# EasyEDA schematic schematic.json
TITLE: Sheet_1; REV: 1.0; Date: 2024-07-02; Sheet: 1/1; Drawn By: usedgenes; Company: Your Company
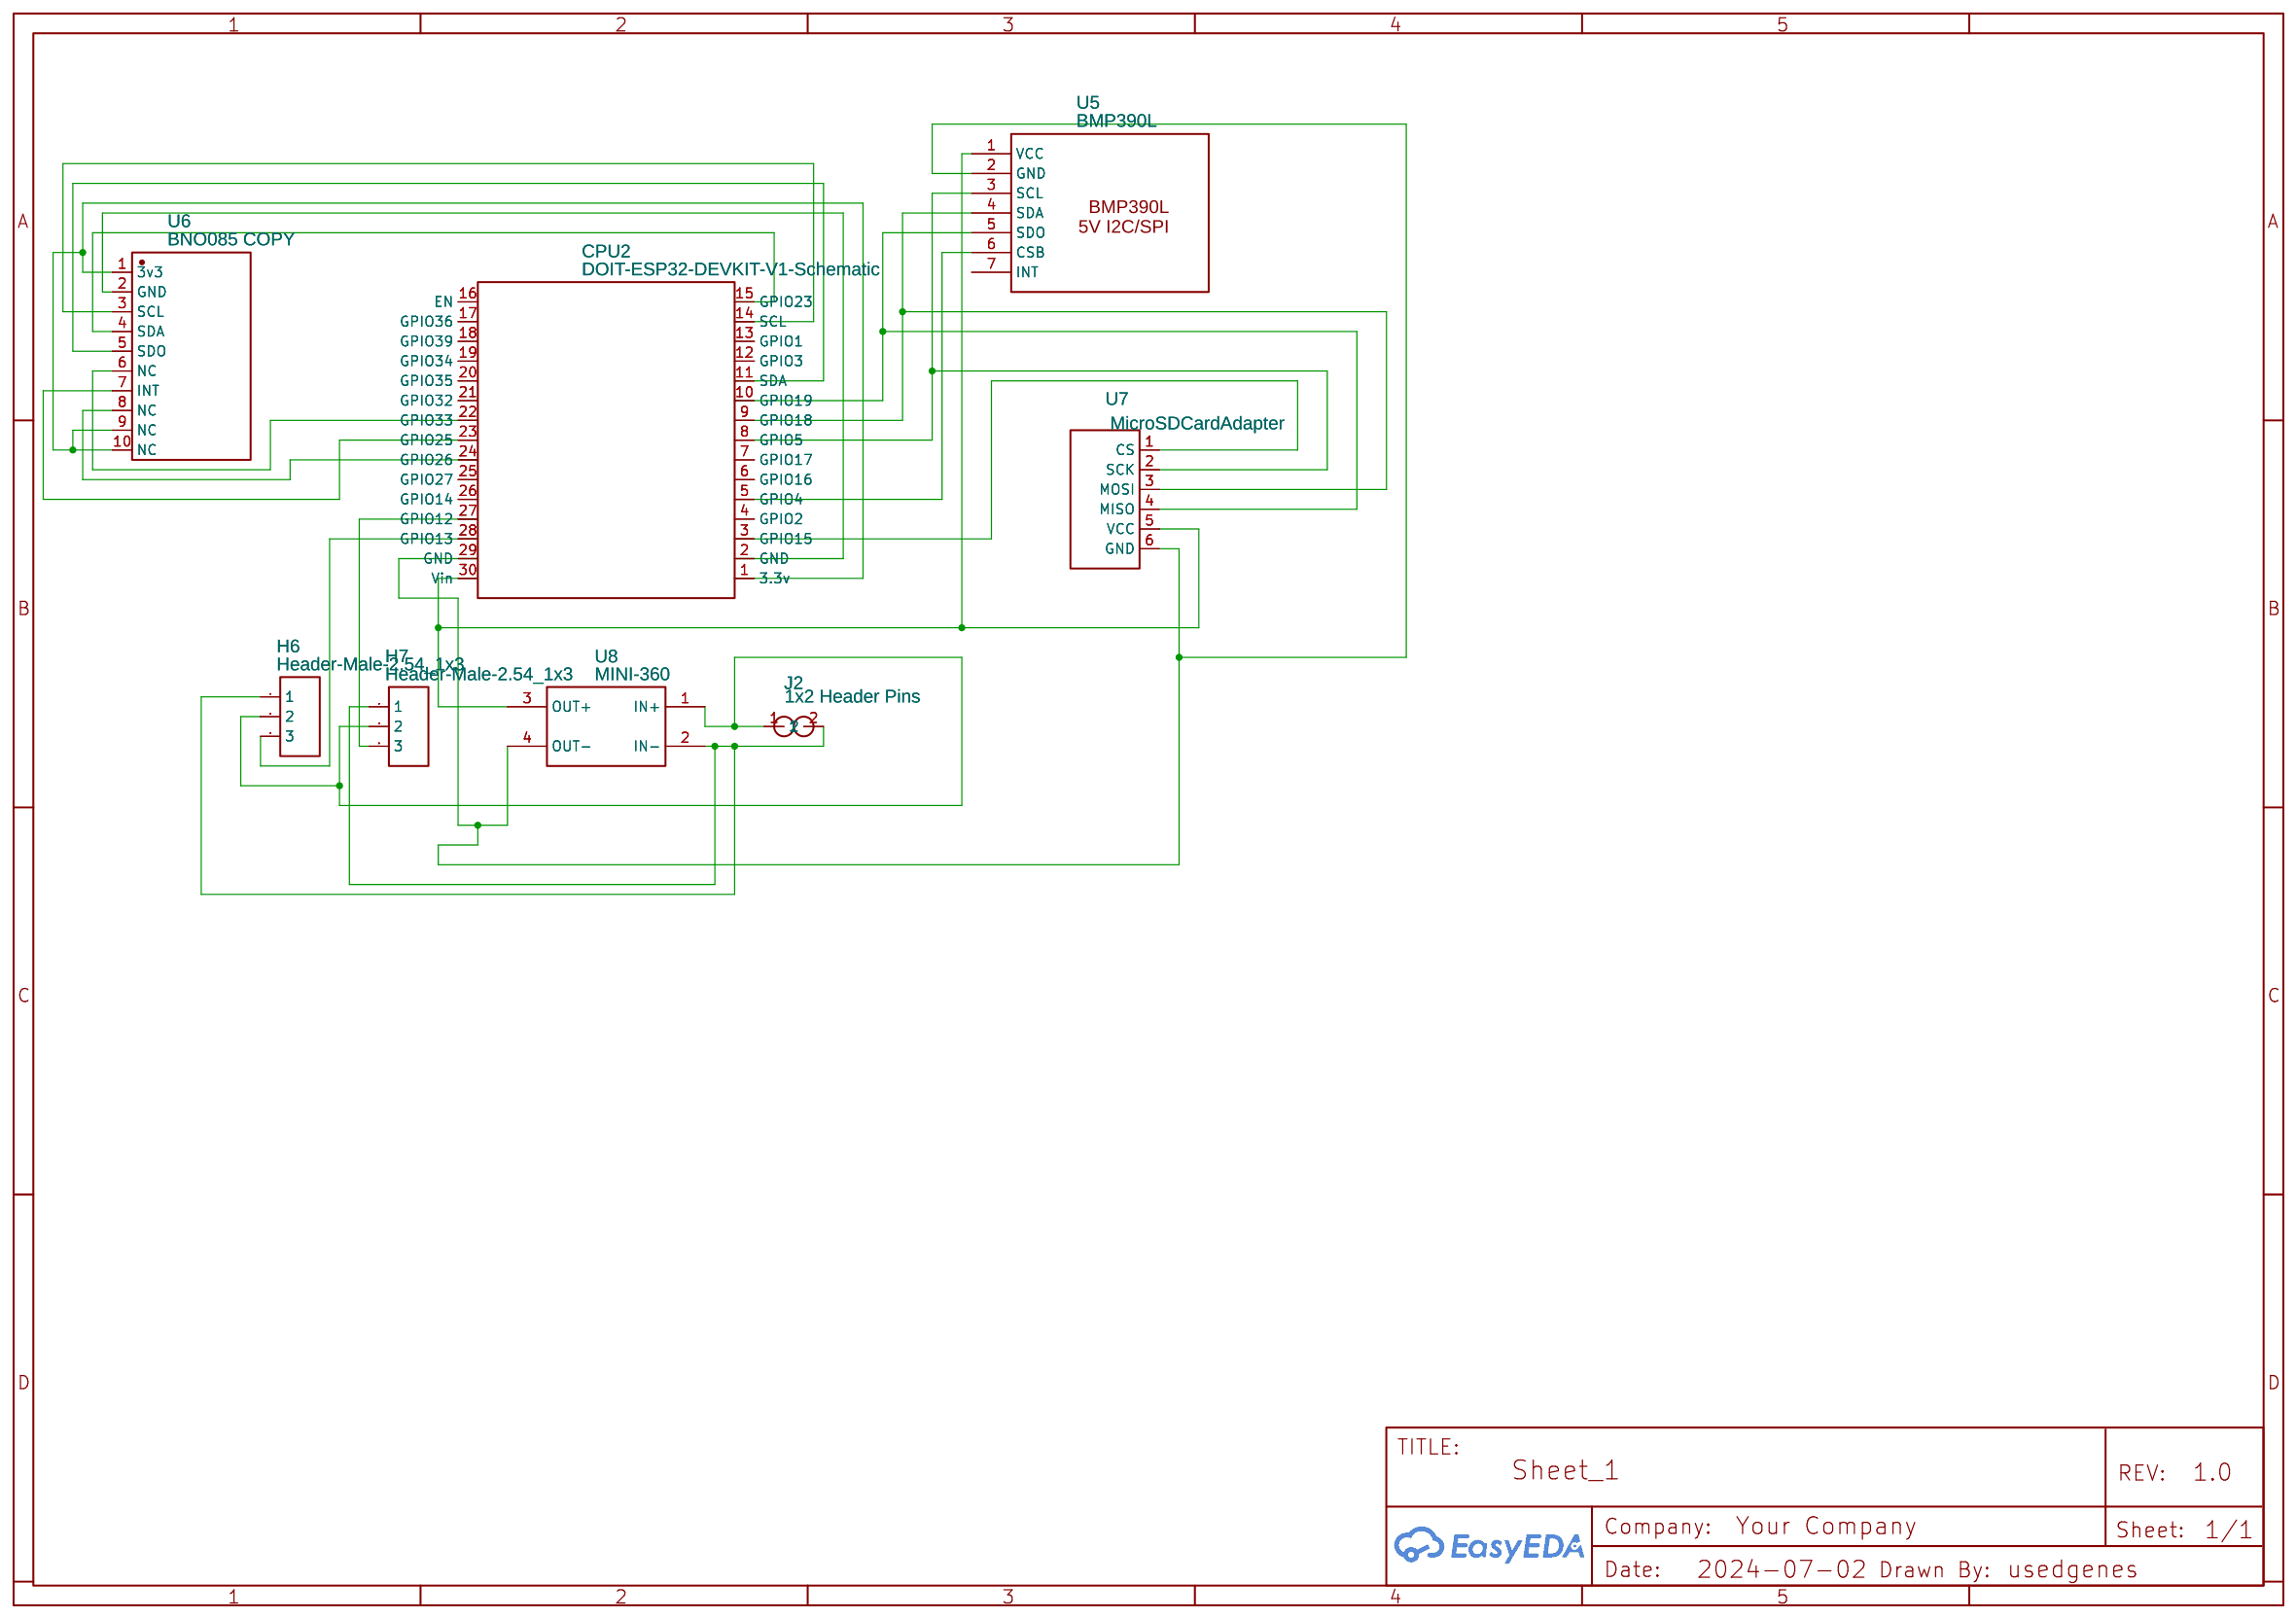
[diagram p0: schematic sheet]

## Parts
CPU2  DOIT-ESP32-DEVKIT-V1-Schematic  [DOIT-ESP32-DEVKIT-V1]
H6  Header-Male-2.54_1x3  [HDR-TH_3P-P2.54-V-M-1]
H7  Header-Male-2.54_1x3  [HDR-TH_3P-P2.54-V-M-1]
J2  1x2 Header Pins  [1X2 HEADER PINS 61300211121]
U5  BMP390L  [BMP390L]
U6  BNO085 COPY  [BNO085_NEW]
U7  MicroSDCardAdapter  [MICROSDCARDADAPTER]
U8  MINI-360  [DSN-MINI-360]

## Library data of the parts
CPU2 = DOIT-ESP32-DEVKIT-V1-Schematic: Manufacturer: NONE; Manufacturer Part: NONE; Supplier Part: NONE; link: NONE; Contributor: rado_nd
H6 H7 = Header-Male-2.54_1x3: Supplier: LCSC; Manufacturer: BOOMELE(博穆精密); Manufacturer Part: 2.54-1*3P针; Supplier Part: C49257; JLCPCB Part Class: Extended Part
J2 = 1x2 Header Pins: Manufacturer: Wurth Electronics; Manufacturer Part: 61300211121; Supplier: Digi-Key; Supplier Part: 732-5315-ND; link: https://katalog.we-online.de/em/datasheet/6130xx11121.pdf; Contributor: agupta
U5 = BMP390L: Manufacturer: ditmore; Manufacturer Part: BME280; Supplier: Amazon; Supplier Part: B07S67TV83; Contributor: Eric Layton
U6 = BNO085 COPY: Manufacturer: Slime; Manufacturer Part: BNO085; Supplier Part: BNO085; Contributor: tmandel
U7 = MicroSDCardAdapter: Contributor: dalewski; Package Display: No
U8 = MINI-360: Contributor: RaspAutomacao

## Nets
Net-(CPU2-1): CPU2.1(3.3v) U6.1(3v3) U6.9(NC) U6.10(NC)
Net-(CPU2-2): CPU2.2(GND) U6.2(GND)
Net-(CPU2-3): CPU2.3(GPIO15) U7.1(CS)
Net-(CPU2-5): CPU2.5(GPIO4) U5.6(CSB)
Net-(CPU2-8): CPU2.8(GPIO5) U5.3(SCL) U7.2(SCK)
Net-(CPU2-9): CPU2.9(GPIO18) U5.4(SDA) U7.3(MOSI)
Net-(CPU2-10): CPU2.10(GPIO19) U5.5(SDO) U7.4(MISO)
Net-(CPU2-11): CPU2.11(SDA) U6.5(SDO)
Net-(CPU2-14): CPU2.14(SCL) U6.3(SCL)
Net-(CPU2-15): CPU2.15(GPIO23) U6.4(SDA)
Net-(CPU2-22): CPU2.22(GPIO33) U6.6(NC)
Net-(CPU2-23): CPU2.23(GPIO25) U6.7(INT)
Net-(CPU2-24): CPU2.24(GPIO26) U6.8(NC)
Net-(CPU2-27): CPU2.27(GPIO12) H7.3
Net-(CPU2-28): CPU2.28(GPIO13) H6.3
Net-(CPU2-29): CPU2.29(GND) U5.2(GND) U7.6(GND) U8.4(OUT-)
Net-(CPU2-30): CPU2.30(Vin) U5.1(VCC) U7.5(VCC) U8.3(OUT+)
Net-(H6-1): H6.1 H7.1 J2.2 U8.2(IN-)
Net-(H6-2): H6.2 H7.2 J2.1 U8.1(IN+)

Not connected (* = marked no-connect by the designer): CPU2 4(GPIO2) 6(GPIO16) 7(GPIO17) 12(GPIO3) 13(GPIO1) 16(EN) 17(GPIO36) 18(GPIO39) 19(GPIO34) 20(GPIO35) 21(GPIO32) 25(GPIO27) 26(GPIO14); U5 7(INT)
